# Altium project Camera Board.PrjPcb
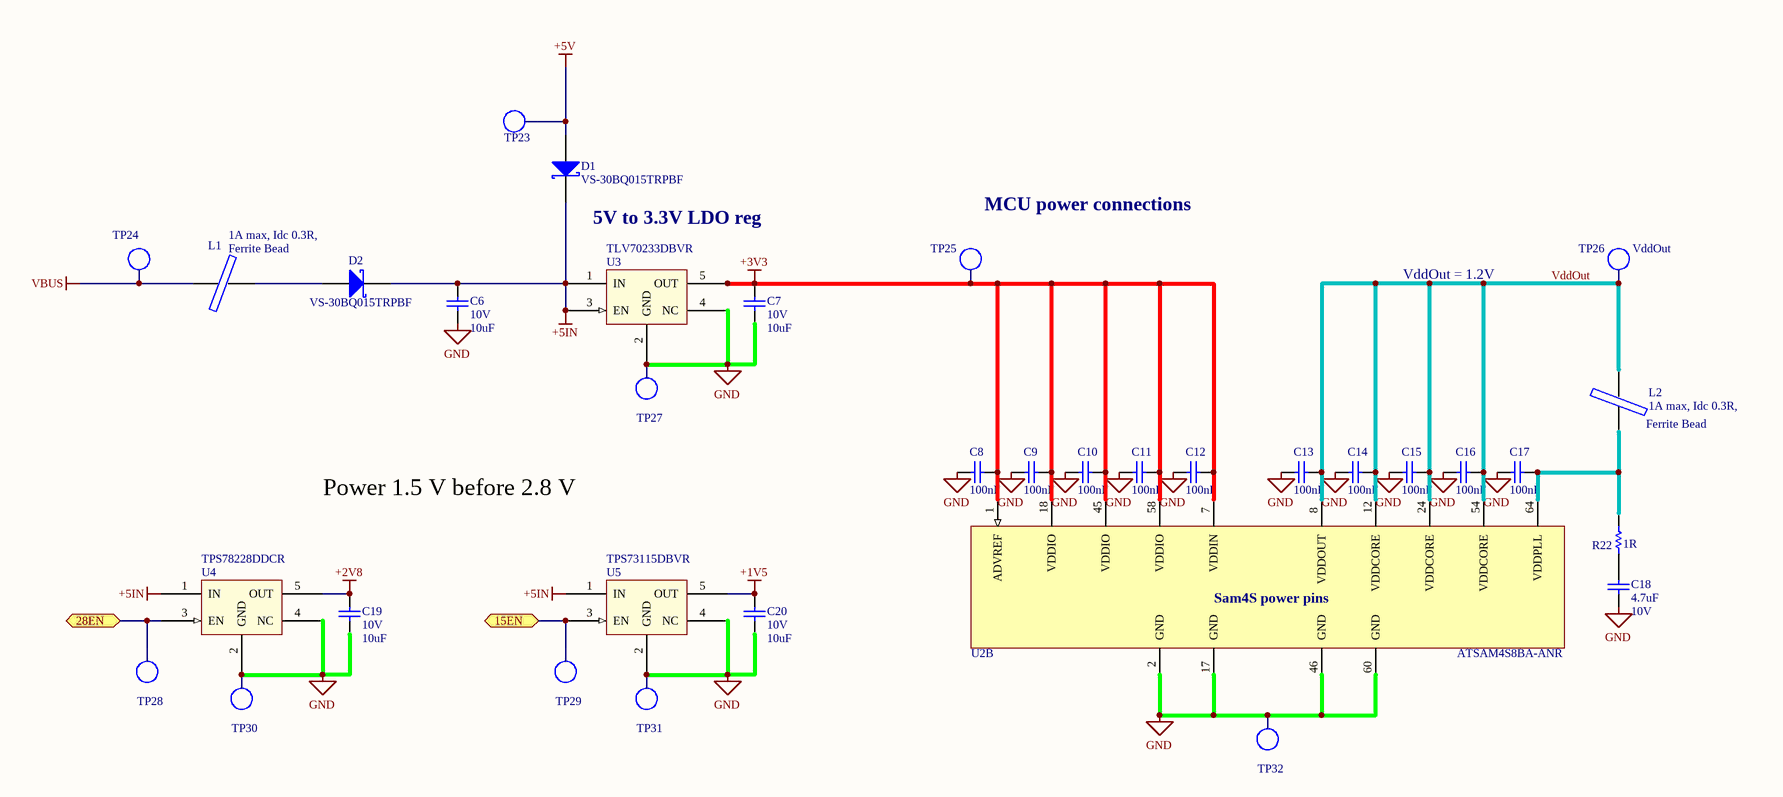
[diagram p0: Power_Distribution.SchDoc]
3 sheets, 98 parts. Net scope: flat (ports and power ports of the same name join across sheets).
Board file: Camera Board PCB.PcbDoc
Sheets:
  Power_Distribution.SchDoc
  Camera.SchDoc
  Camera_Board.SchDoc

## Sheet Power_Distribution.SchDoc: Sam4S Power Distribution - Group 7
size A3; DrawnBy: Lakshay Duggal, Thomas Hu; Address1: ECE Department; Address2: University of Canterbury; Address3: Christchurch 8041; Address4: New Zealand; Revision: 2; SheetNumber: 2; SheetTotal: 2; PageSetup: Record=PageOptions|CenterHorizontal=True|CenterVertical=True|PrintScale=1.04|XCorrection=1.00|YCorrection=1.00|PrintKind=0|BorderSize=5000000|LeftOffset=0|BottomOffset=0|Orientation=2|PaperLength=1000|PaperWidth=1000|Scale=100|PaperSource=7|PrintQuality=-3|MediaType=1|DitherType=10|PrintScaleMode=1|PaperKind=A3|PaperIndex=8

### Parts
C6  Voltage - Rated: 10V  [CAPC1608L]  (hidden comment: 10uF)
C7  Voltage - Rated: 10V  [CAPC1608L]  (hidden comment: 10uF)
C8  100nF  [CAPC1608L]
C9  100nF  [CAPC1608L]
C10  100nF  [CAPC1608L]
C11  100nF  [CAPC1608L]
C12  100nF  [CAPC1608L]
C13  100nF  [CAPC1608L]
C14  100nF  [CAPC1608L]
C15  100nF  [CAPC1608L]
C16  100nF  [CAPC1608L]
C17  100nF  [CAPC1608L]
C18  Max Voltage: 10V  [CAPC1608N]  (hidden comment: 4.7uF)
C19  Voltage - Rated: 10V  [CAPC1608L]  (hidden comment: 10uF)
C20  Voltage - Rated: 10V  [CAPC1608L]  (hidden comment: 10uF)
D1  VS-30BQ015TRPBF  [SMC]
D2  VS-30BQ015TRPBF  [SMC]
L1  Ferrite Bead  value 1A max, Idc 0.3R,  [INDC3216L]
L2  Ferrite Bead  value 1A max, Idc 0.3R,  [INDC3216L]
R22  1R  [RESC3216L]
TP23  V_Bus  [TP_0805]  (value not drawn)
TP24  V_Bus  [TP_0805]  (value not drawn)
TP25  3V3  [TP_0805]  (value not drawn)
TP26  VddOut  [TP_0805]
TP27  Gnd  [TP_0805]  (value not drawn)
TP28  Gnd  [TP_0805]  (value not drawn)
TP29  Gnd  [TP_0805]  (value not drawn)
TP30  Gnd  [TP_0805]  (value not drawn)
TP31  Gnd  [TP_0805]  (value not drawn)
TP32  Gnd  [TP_0805]  (value not drawn)
U2  ATSAM4S8BA-ANR  [LQFP64_L]  (part B of 2)
U3  TLV70233DBVR  [SOT95P280X145-5N]
U4  TPS78228DDCR  [SOT95P280X145-5N]
U5  TPS73115DBVR  [SOT95P280X145-5N]

### Ports
15EN, 28EN

### Nets
+1V5: C20.1 U5.5(OUT)
+2V8: C19.1 U4.5(OUT)
+3V3: C7.1 C8.2 C9.2 C10.2 C11.2 C12.2 TP25.1(TP) U2.1(ADVREF) U2.7(VDDIN) U2.18(VDDIO) U2.45(VDDIO) U2.58(VDDIO) U3.5(OUT)
+5IN: C6.1 D1.2(K) D2.2(K) U3.1(IN) U3.3(EN) U4.1(IN) U5.1(IN)
+5V: D1.1(A) TP23.1(TP)
GND: C6.2 C7.2 C8.1 C9.1 C10.1 C11.1 C12.1 C13.1 C14.1 C15.1 C16.1 C17.1 C18.1 C19.2 C20.2 TP27.1(TP) TP30.1(TP) TP31.1(TP) TP32.1(TP) U2.2(GND) U2.17(GND) U2.46(GND) U2.60(GND) U3.2(GND) U3.4(NC) U4.2(GND) U4.4(NC) U5.2(GND) U5.4(NC)
VBUS: L1.1 TP24.1(TP)
VddOut: C13.2 C14.2 C15.2 C16.2 L2.2 TP26.1(TP) U2.8(VDDOUT) U2.12(VDDCORE) U2.24(VDDCORE) U2.54(VDDCORE)
NetC17_2: C17.2 L2.1 R22.2 U2.64(VDDPLL)
NetC18_2: C18.2 R22.1
NetD2_1: D2.1(A) L1.2
NetTP28_1: TP28.1(TP) U4.3(EN) ; port 28EN
NetTP29_1: TP29.1(TP) U5.3(EN) ; port 15EN

### Notes on the sheet
- 5V to 3.3V LDO reg
- MCU power connections
- VddOut = 1.2V
- Power 1.5 V before 2.8 V
- (near U2) Sam4S power pins
- Title
- Drawn by:
- Date:
- Time:
- Revision:
- Sheet
- of
- File:

### Library data of the parts
C6 C7 C19 C20 = CC_10uF_0603: CAP CER 10UF X5R +-20% 10V 0603; Supplier: ECE Dept; Storage Location: PCB Assembly WS; Value: 10uF
C8-C17 = CC_100nF_0603: CAP CER 100nF X7R +-10% 50V 0603; PackageReference: 0603; Code_IPC: 1608 [0603]; Verify: *; Supplier: ECE Dept; Storage Location: PCB Assembly WS; Value: 100nF
C18 = CC_4.7uF_0603: CAP CER 4.7uF X5R +-20%  10V 0603; Note: Footprint corresponds to dimensions for bulk cassette packaging. This case size has tightened tolerances.; PackageReference: 0805; Code_IPC: 2012[0805]; Verify: *; Supplier: ECE Dept; Storage Location: PCB Assembly WS; Value: 4.7uF
D1 D2 = DS_VS-30BQD015TRPBF: DIODE SCHOTTKY 15V 3A SMC; Manufacturer: Vishay Semiconductor Diodes Division; Current - Reverse Leakage @ Vr: 4mA @ 15V; Voltage - Forward (Vf) (Max) @ If: 350mV @ 3A; Current - Average Rectified (Io): 3A; Package / Case: DO-214AB, SMC; Pricing: 1=1.59, 10=1.417, 25=1.2504, 100=1.1253, 250=0.97944, 500=0.87526, 1000=0.6877 (NZD); Supplier 1: Digi-Key; Supplier Part Number 1: 30BQ015PBFCT-ND; Supplier 2: Farnell; Supplier Part Number 2: 9101250; Supplier 3: Mouser; Supplier Part Number 3: N/A; Storage Location: PCB Assembly WS; Supplier: ECE Dept; Manufacturer Part Number: VS-30BQ015TRPBF
L1 L2 = IN_Ferrite-Bead: Ferrite Bead, Rdc 0.3R, Z100MHZ 600R, Imax 1A, SMD 1206; Manufacturer: FAIR-RITE; Manufacturer PN: 2512066017Y1; DC Current Rating: 1; DC Resistance Max: 0.08; Ferrite Case Style: 1206 ^3216 Metric]; Frequency Range: 50MHz to 1; Impedance: 600; Impedance Tolerance: ± 25%; Supplier: ECE Dept; Storage Location: PCB Assembly WS; Ferrite Mounting: SMD; Supplier 1: Farnell; Supplier Part Number 1: 1612060; Manufacturer Part Number: 2512066017Y1
R22 = RT_1R: RES 1R OHM 1/4W 5% 1206 SMD; Storage Location: PCB Assembly WS; Supplier: ECE Dept; Value: 1R
TP23-TP32 = TP_0805: Test Point 2.0X0.9X1.2mm SMD; Manufacturer: TE Connectivity AMP Connectors; Manufacturer Part Number: 1625854-2; Supplier 1: Digi-Key; Mounting Type: Surface Mount; Terminal: 0.079" x 0.049" x 0.057" (2.00mm x 1.25mm x 1.45mm); Type: PC Test Point; Supplier Part Number 1: A106144CT-ND
U2 = SE_ATSAM4S16BA-MU: IC MCU 32BIT 512KB FLASH 64LQFP; Manufacturer: Atmel; Connectivity: I²C, IrDA, Memory Card, SPI, SSC, UART/USART, USB; Core Processor: ARM® Cortex®-M4; Core Size: 32-Bit; Data Converters: A/D 11x12b, D/A 2x12b; Number of I/O: 47; Peripherals: Brown-out Detect/Reset, DMA, POR, PWM, WDT; Program Memory Size: 512KB (512K x 8); RAM Size: 128K x 8; Speed: 120MHz; Voltage - Supply (Vcc/Vdd): 1.62 V ~ 3.6 V; PackageVersion: revJ, Jul-2007; PackageReference: 64PS; PackageDescription: 64-Pin Quad Flat No-Lead (QFN) Sawn, 9 x 9 x 1.0 mm Body, 0.5 mm Pitch, Exposed Pad; Code_JEDEC: MO-220VMMD-3; ComponentLink1Description: Manufacturer URL; ComponentLink1URL: http://www.atmel.com/; ComponentLink2Description: SAM4S Series Datasheet; ComponentLink2URL: http://www.atmel.com/dyn/resources/prod_documents/11100.pdf; ComponentLink3Description: SAM4S Series Summary; ComponentLink3URL: http://www.atmel.com/dyn/resources/prod_documents/11100S.pdf; Supplier 1: Digi-Key; Package / Case: 64-LQFP; Packaging: Cut Tape (CT); Program Memory Type: FLASH; Supplier Part Number 1: ATSAM4S8BA-ANRCT-ND; Manufacturer Part Number: ATSAM4S8BA-ANR
U3 = SV_TLV70233DBVR: IC REG LDO 3.3V 0.3A SOT23-5; Manufacturer: Texas Instruments; Current - Output: 300mA; Supplier 1: Digi-Key; Operating Temperature: -40°C ~ 125°C; Package / Case: SC-74A, SOT-753; Pricing: 1=0.77, 10=0.647, 25=0.5672, 100=0.4853, 250=0.421, 500=0.35658, 750=0.30789, 1000=0.2749 (NZD); Supplier Part Number 1: 296-32415-1-ND; Manufacturer Part Number: TLV70233DBVR
U4 = SV_TLV70233DBVR: IC REG LDO 2.8V 0.3A SOT23-5; Manufacturer: Texas Instruments; Current - Output: 300mA; Supplier 1: Digi-Key; Operating Temperature: -40°C ~ 125°C; Package / Case: SC-74A, SOT-753; Pricing: 1=0.77, 10=0.647, 25=0.5672, 100=0.4853, 250=0.421, 500=0.35658, 750=0.30789, 1000=0.2749 (NZD); Supplier Part Number 1: 296-23826-2-ND; Manufacturer Part Number: TPS78228DDCR
U5 = SV_TLV70233DBVR: IC REG LDO 1.5V 0.3A SOT23-5; Manufacturer: Texas Instruments; Current - Output: 300mA; Supplier 1: Digi-Key; Operating Temperature: -40°C ~ 125°C; Package / Case: SC-74A, SOT-753; Pricing: 1=0.77, 10=0.647, 25=0.5672, 100=0.4853, 250=0.421, 500=0.35658, 750=0.30789, 1000=0.2749 (NZD); Supplier Part Number 1: 296-41769-2-ND; Manufacturer Part Number: TPS73115DBVR

## Sheet Camera.SchDoc: Camera Chip - Group 7
size A4; DrawnBy: Lakshay Duggal, Thomas Hu; Revision: 1.0; PageSetup: Record=PageOptions|CenterHorizontal=True|CenterVertical=True|PrintScale=1.42|XCorrection=1.00|YCorrection=1.00|PrintKind=1|BorderSize=5000000|LeftOffset=0|BottomOffset=0|Orientation=2|PaperLength=1000|PaperWidth=1000|Scale=100|PaperSource=7|PrintQuality=-3|MediaType=1|DitherType=10|PrintScaleMode=1|PaperKind=A3|PaperIndex=8
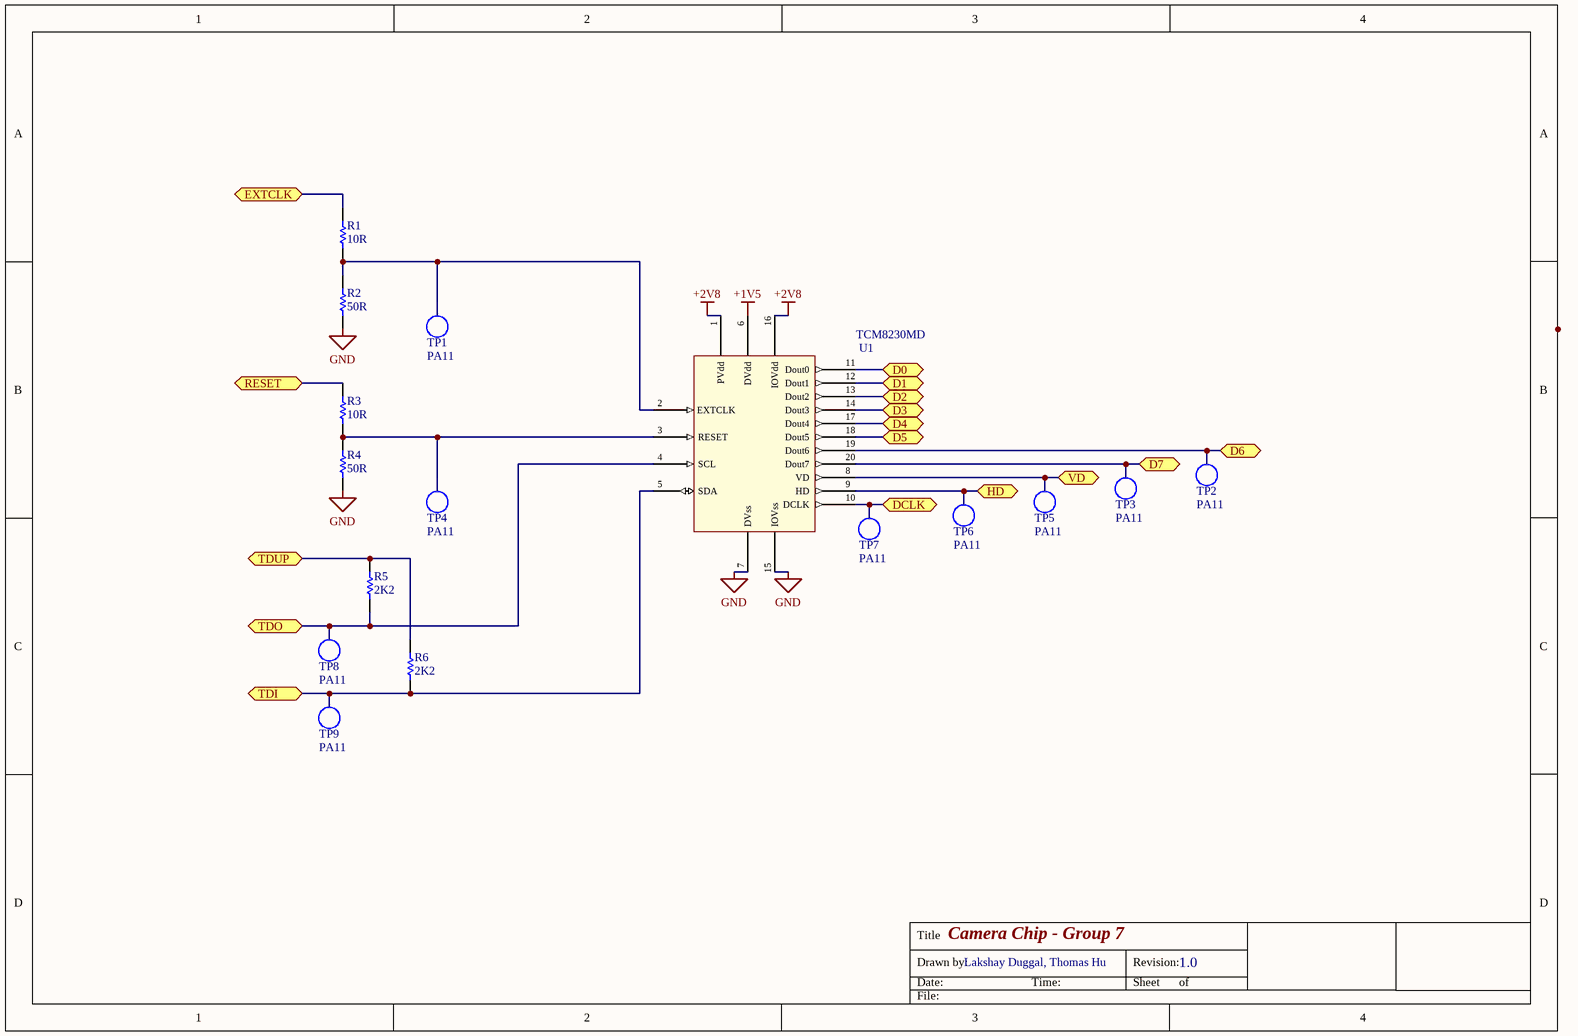
[diagram p1: Camera.SchDoc]

### Parts
R1  10R  [RESC1608L]
R2  50R  [RESC1608L]
R3  10R  [RESC1608L]
R4  50R  [RESC1608L]
R5  2K2  [RESC1608L]
R6  2K2  [RESC1608L]
TP1  PA11  [TP_0805]
TP2  PA11  [TP_0805]
TP3  PA11  [TP_0805]
TP4  PA11  [TP_0805]
TP5  PA11  [TP_0805]
TP6  PA11  [TP_0805]
TP7  PA11  [TP_0805]
TP8  PA11  [TP_0805]
TP9  PA11  [TP_0805]
U1  TCM8230MD  [TCM8230MD]

### Ports
D0, D1, D2, D3, D4, D5, D6, D7, DCLK, EXTCLK, HD, RESET, TDI, TDO, TDUP, VD

### Nets
+1V5: U1.6(DVdd)
+2V8: U1.1(PVdd) U1.16(IOVdd)
GND: R2.1 R4.1 U1.7(DVss) U1.15(IOVss)
NetR1_1: R1.1 R2.2 TP1.1(TP) U1.2(EXTCLK)
NetR1_2: R1.2 ; port EXTCLK
NetR3_1: R3.1 R4.2 TP4.1(TP) U1.3(RESET)
NetR3_2: R3.2 ; port RESET
NetR5_1: R5.1 TP8.1(TP) U1.4(SCL) ; port TDO
NetR5_2: R5.2 R6.2 ; port TDUP
NetR6_1: R6.1 TP9.1(TP) U1.5(SDA) ; port TDI
NetTP2_1: TP2.1(TP) U1.19(Dout6) ; port D6
NetTP3_1: TP3.1(TP) U1.20(Dout7) ; port D7
NetTP5_1: TP5.1(TP) U1.8(VD) ; port VD
NetTP6_1: TP6.1(TP) U1.9(HD) ; port HD
NetTP7_1: TP7.1(TP) U1.10(DCLK) ; port DCLK
NetU1_11: U1.11(Dout0) ; port D0
NetU1_12: U1.12(Dout1) ; port D1
NetU1_13: U1.13(Dout2) ; port D2
NetU1_14: U1.14(Dout3) ; port D3
NetU1_17: U1.17(Dout4) ; port D4
NetU1_18: U1.18(Dout5) ; port D5

### Notes on the sheet
- Title
- Drawn by:
- Date:
- Time:
- Revision:
- Sheet
- of
- File:

### Library data of the parts
R1-R6 = RS_2K2: RES 2.2K OHM 1/10W 5% 0603 SMD; Storage Location: PCB Assembly WS; Supplier: ECE Dept
  R1 R3: Value: 10R
  R2 R4: Value: 50R
  R5 R6: Value: 2K2
TP1-TP9 = TP_0805: as TP23 on sheet Power_Distribution; Supplier 1: Digi-Key; Mounting Type: Surface Mount; Terminal: 0.079" x 0.049" x 0.057" (2.00mm x 1.25mm x 1.45mm); Type: PC Test Point; Supplier Part Number 1: A106144CT-ND
U1 = TCM8230MD: Toshiba I2C Camera; Manufacturer: Toshiba; Manufacturers PN: TCM8230MD; Supplier 1: Spark Fun; Supplier 1 PN: 8667

## Sheet Camera_Board.SchDoc: Camera Board - Group 7
size A3; DrawnBy: Lakshay duggal, Thomas Hu; Address1: ECE Department; Address2: University of Canterbury; Address3: Christchurch 8041; Address4: New Zealand; Revision: 2; SheetNumber: 1; SheetTotal: 2; PageSetup: Record=PageOptions|CenterHorizontal=True|CenterVertical=True|PrintScale=1.04|XCorrection=1.00|YCorrection=1.00|PrintKind=0|BorderSize=5000000|LeftOffset=0|BottomOffset=0|Orientation=2|PaperLength=1000|PaperWidth=1000|Scale=100|PaperSource=7|PrintQuality=-3|MediaType=1|DitherType=10|PrintScaleMode=1|PaperKind=A3|PaperIndex=8
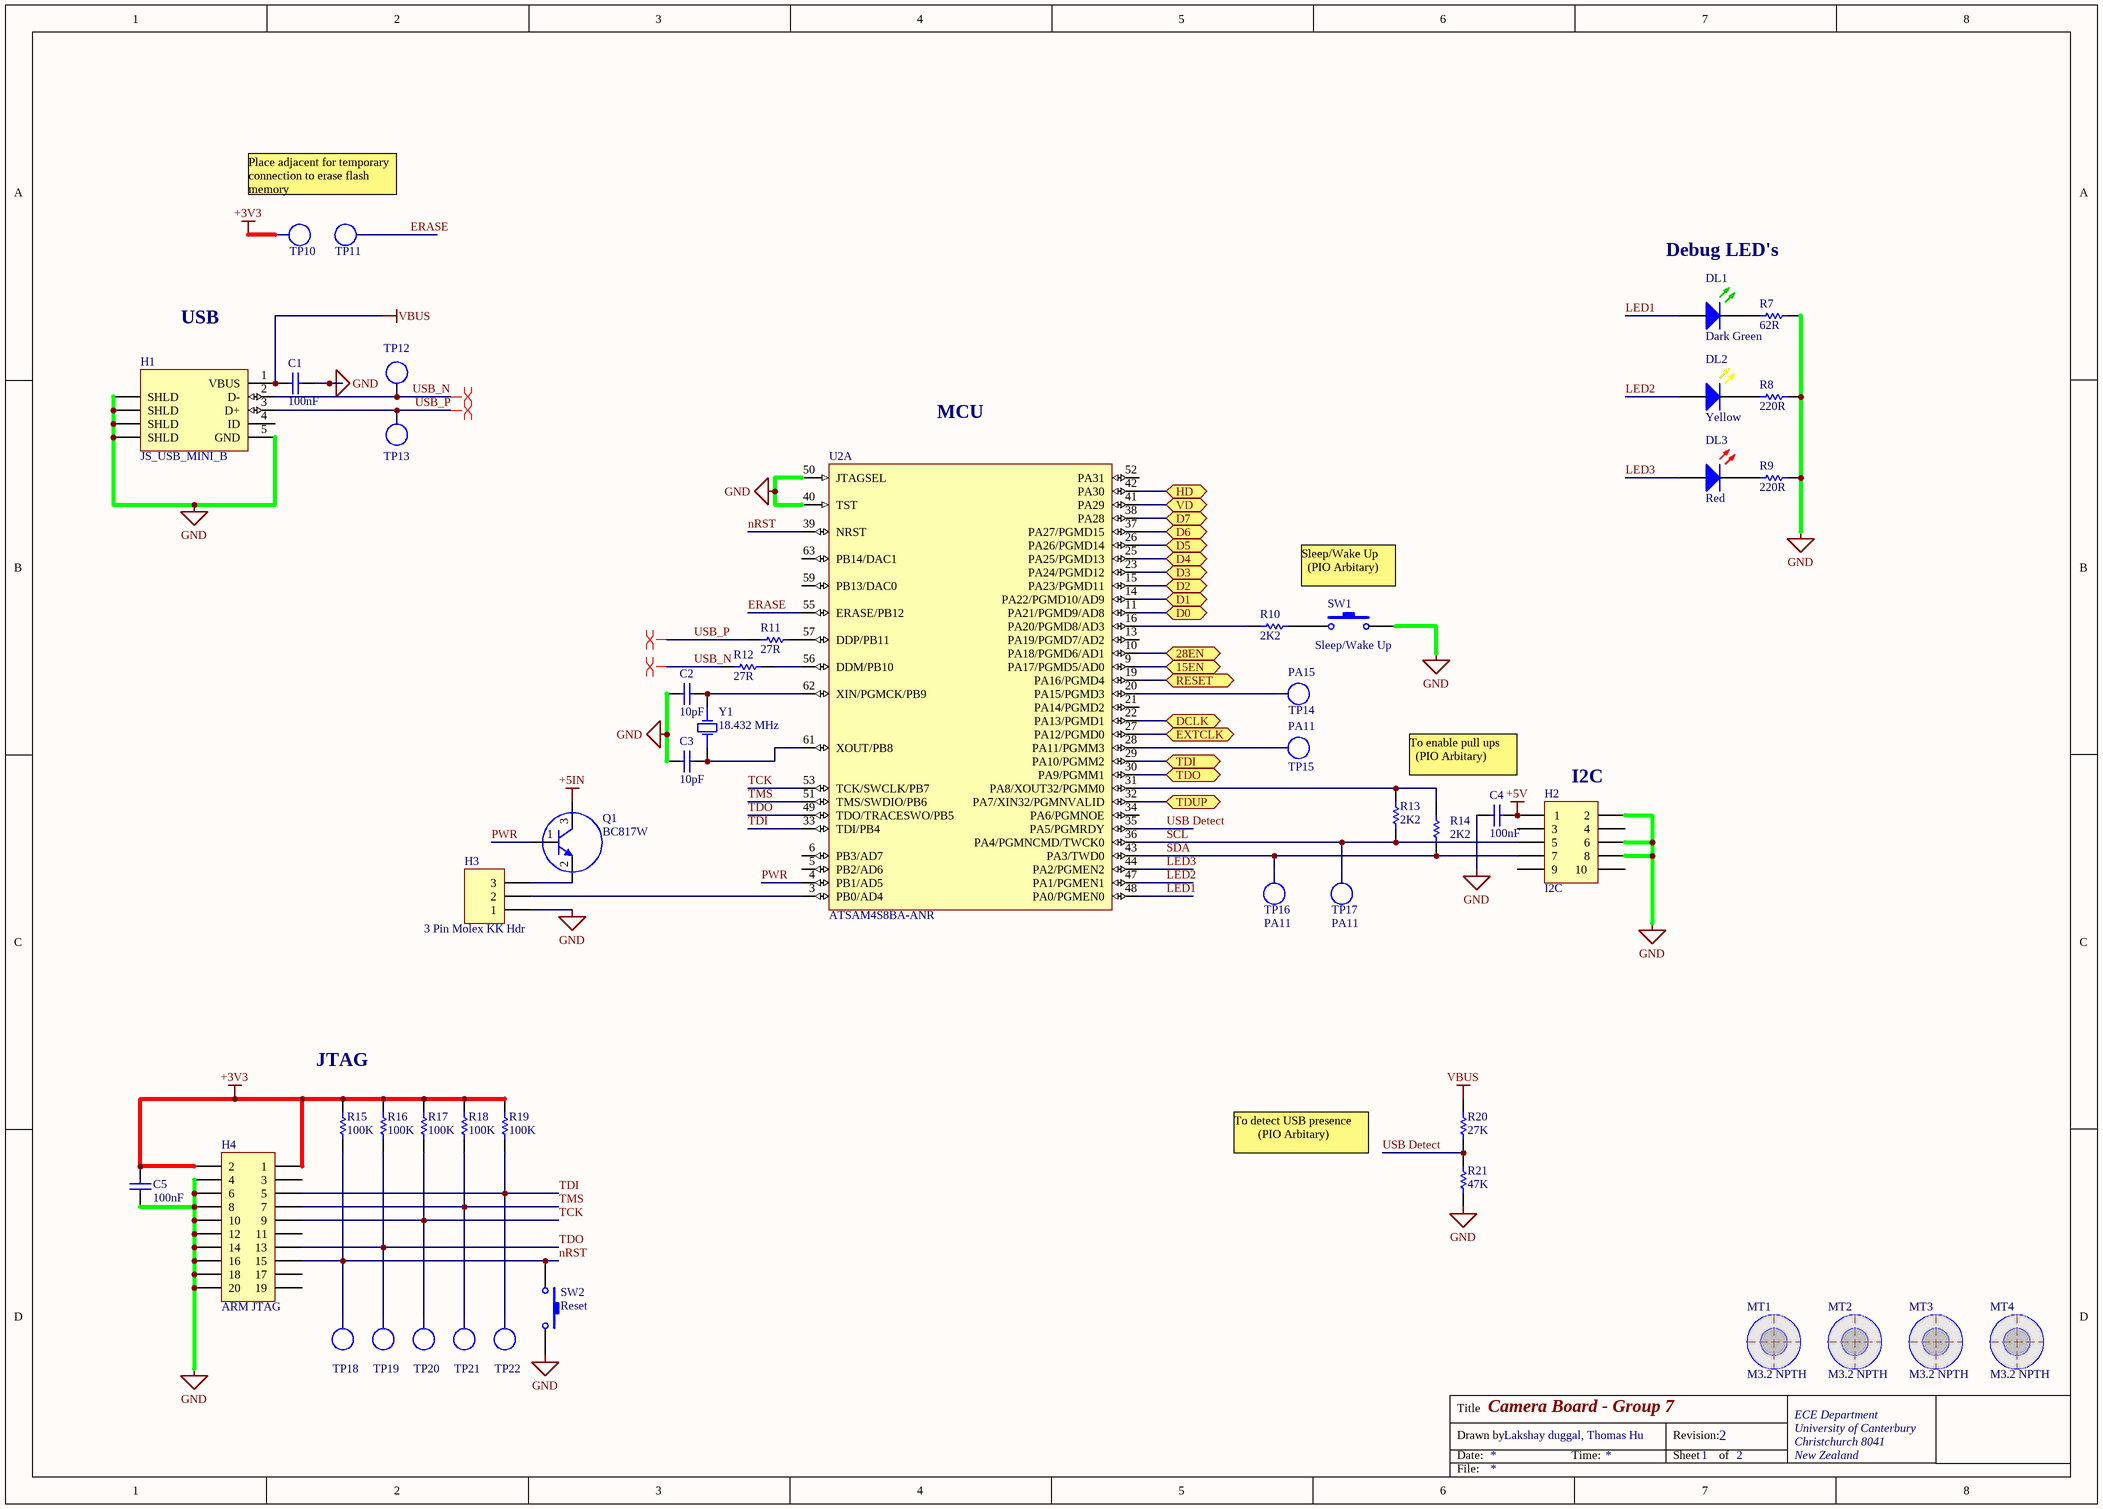
[diagram p2: Camera_Board.SchDoc]

### Parts
C1  100nF  [CAPC1608L]
C2  10pF  [CAPC1608L]
C3  10pF  [CAPC1608L]
C4  100nF  [CAPC1608L]
C5  100nF  [CAPC1608L]
DL1  Dark Green  [WL-SMCW0603]
DL2  Yellow  [WL-SMCW0603]
DL3  Red  [WL-SMCW0603]
H1  JS_USB_MINI_B  [USB/SM0.8-6H5]
H2  I2C  [188275-10]
H3  3 Pin Molex KK Hdr  [MOLEX_KK_3_HDR]
H4  ARM JTAG  [188275-20]
MT1  M3.2 NPTH  [MNT-HOLE_3.2mm_NPTH]  (no BOM)
MT2  M3.2 NPTH  [MNT-HOLE_3.2mm_NPTH]  (no BOM)
MT3  M3.2 NPTH  [MNT-HOLE_3.2mm_NPTH]  (no BOM)
MT4  M3.2 NPTH  [MNT-HOLE_3.2mm_NPTH]  (no BOM)
Q1  BC817W  [SOT323_M]
R7  62R  [RESC1608L]
R8  220R  [RESC1608L]
R9  220R  [RESC1608L]
R10  2K2  [RESC1608L]
R11  27R  [RESC1608L]
R12  27R  [RESC1608L]
R13  2K2  [RESC1608L]
R14  2K2  [RESC1608L]
R15  100K  [RESC1608L]
R16  100K  [RESC1608L]
R17  100K  [RESC1608L]
R18  100K  [RESC1608L]
R19  100K  [RESC1608L]
R20  27K  [RESC1608N]
R21  47K  [RESC1608N]
SW1  Sleep/Wake Up  [KSR211G]
SW2  Reset  [KSR211G]
TP10  3V3  [TP_0805]  (value not drawn)
TP11  Erase  [TP_0805]  (value not drawn)
TP12  USB_N  [TP_0805]  (value not drawn)
TP13  USB_P  [TP_0805]  (value not drawn)
TP14  PA15  [TP_0805]
TP15  PA11  [TP_0805]
TP16  PA11  [TP_0805]
TP17  PA11  [TP_0805]
TP18  nRST  [TP_0805]  (value not drawn)
TP19  TDO  [TP_0805]  (value not drawn)
TP20  TCK  [TP_0805]  (value not drawn)
TP21  TMS  [TP_0805]  (value not drawn)
TP22  TDI  [TP_0805]  (value not drawn)
U2  ATSAM4S8BA-ANR  [LQFP64_L]  (part A of 2)
Y1  18.432 MHz  [6.0X3.5-4]

### Ports
15EN, 28EN, D0, D1, D2, D3, D4, D5, D6, D7, DCLK, EXTCLK, HD, RESET, TDI, TDO, TDUP, VD

### Nets
+3V3: C5.2 H4.1 H4.2 R15.2 R16.2 R17.2 R18.2 R19.2 TP10.1(TP)
+5IN: Q1.3
+5V: C4.2 H2.1
GND: C1.2 C2.1 C3.1 C4.1 C5.1 H1.5(GND) H1.6(SHLD) H1.7(SHLD) H1.8(SHLD) H1.9(SHLD) H2.2 H2.6 H2.8 H3.1 H4.4 H4.6 H4.8 H4.10 H4.12 H4.14 H4.16 H4.18 H4.20 R7.2 R8.2 R9.2 R21.1 SW1.2 SW2.2 U2.40(TST) U2.50(JTAGSEL)
VBUS: C1.1 H1.1(VBUS) R20.2
ERASE: TP11.1(TP) U2.55(ERASE/PB12)
LED1: DL1.2(A) U2.48(PA0/PGMEN0)
LED2: DL2.2(A) U2.47(PA1/PGMEN1)
LED3: DL3.2(A) U2.44(PA2/PGMEN2)
nRST: H4.15 R15.1 SW2.1 TP18.1(TP) U2.39(NRST)
PWR: Q1.1 U2.4(PB1/AD5)
SCL: H2.5 R13.1 TP17.1(TP) U2.36(PA4/PGMNCMD/TWCK0)
SDA: H2.7 R14.1 TP16.1(TP) U2.43(PA3/TWD0)
TCK: H4.9 R17.1 TP20.1(TP) U2.53(TCK/SWCLK/PB7)
TDI: H4.5 R19.1 TP22.1(TP) U2.33(TDI/PB4)
TDO: H4.13 R16.1 TP19.1(TP) U2.49(TDO/TRACESWO/PB5)
TMS: H4.7 R18.1 TP21.1(TP) U2.51(TMS/SWDIO/PB6)
USB Detect: R20.1 R21.2 U2.35(PA5/PGMRDY)
USB_N: H1.2(D-) R12.1 TP12.1(TP)
USB_P: H1.3(D+) R11.1 TP13.1(TP)
NetC2_2: C2.2 U2.62(XIN/PGMCK/PB9) Y1.3(OSC2)
NetC3_2: C3.2 U2.61(XOUT/PB8) Y1.1(OSC1)
NetDL1_1: DL1.1(K) R7.1
NetDL2_1: DL2.1(K) R8.1
NetDL3_1: DL3.1(K) R9.1
NetH3_2: H3.2 U2.3(PB0/AD4)
NetH3_3: H3.3 Q1.2
NetR1_2: U2.27(PA12/PGMD0) ; port EXTCLK
NetR3_2: U2.19(PA16/PGMD4) ; port RESET
NetR5_1: U2.30(PA9/PGMM1) ; port TDO
NetR5_2: U2.32(PA7/XIN32/PGMNVALID) ; port TDUP
NetR6_1: U2.29(PA10/PGMM2) ; port TDI
NetR10_1: R10.1 U2.16(PA20/PGMD8/AD3)
NetR10_2: R10.2 SW1.1
NetR11_2: R11.2 U2.57(DDP/PB11)
NetR12_2: R12.2 U2.56(DDM/PB10)
NetR13_2: R13.2 R14.2 U2.31(PA8/XOUT32/PGMM0)
NetTP2_1: U2.37(PA27/PGMD15) ; port D6
NetTP3_1: U2.38(PA28) ; port D7
NetTP5_1: U2.41(PA29) ; port VD
NetTP6_1: U2.42(PA30) ; port HD
NetTP7_1: U2.22(PA13/PGMD1) ; port DCLK
NetTP14_1: TP14.1(TP) U2.20(PA15/PGMD3)
NetTP15_1: TP15.1(TP) U2.28(PA11/PGMM3)
NetTP28_1: U2.10(PA18/PGMD6/AD1) ; port 28EN
NetTP29_1: U2.9(PA17/PGMD5/AD0) ; port 15EN
NetU1_11: U2.11(PA21/PGMD9/AD8) ; port D0
NetU1_12: U2.14(PA22/PGMD10/AD9) ; port D1
NetU1_13: U2.15(PA23/PGMD11) ; port D2
NetU1_14: U2.23(PA24/PGMD12) ; port D3
NetU1_17: U2.25(PA25/PGMD13) ; port D4
NetU1_18: U2.26(PA26/PGMD14) ; port D5

Not connected (* = marked no-connect by the designer): H1 4(ID); H2 3 4 9 10; H4 3 11 17 19; U2 5(PB2/AD6) 6(PB3/AD7) 13(PA19/PGMD7/AD2) 21(PA14/PGMD2) 34(PA6/PGMNOE) 52(PA31) 59(PB13/DAC0) 63(PB14/DAC1)

### Layout directives
differential pair: USB_N, USB_P

### Notes on the sheet
- Place adjacent for temporary
  connection to erase flash
  memory
- Debug LED's
- USB
- MCU
- Sleep/Wake Up
  (PIO Arbitary)
- To enable pull ups
  (PIO Arbitary)
- (near H2) I2C
- JTAG
- To detect USB presence
  (PIO Arbitary)
- Title
- Drawn by:
- Date:
- Time:
- Revision:
- Sheet
- of
- File:

### Library data of the parts
C1 C4 C5 = CC_100nF_0603: CAP CER 100nF X7R +-10% 50V 0603; PackageReference: 0603; Code_IPC: 1608 [0603]; Verify: *; Supplier: ECE Dept; Storage Location: PCB Assembly WS; Value: 100nF
C2 C3 = CC_10pF_0603: CAP CER 10pF COG/NPO 50V 0603; PackageReference: 0603; Code_IPC: 1005 [0402]; Verify: *; Supplier: ECE Dept; Storage Location: PCB Assembly WS; Value: 10pF
DL1 = DL_150060GS75000: LED Dk Green 430mcd 0603 SMD; Manufacturer: WURTH ELEKTRONIK; Forward Current If: 30; Wavelength Typ: 520; Forward Voltage: 3.2; Lens Shape: Rectangular; Luminous Intensity: 430; Viewing Angle: 140°; LED Mounting: SMD; Supplier 1: Farnell; Supplier Part Number 1: 2322070; Manufacturer Part Number: 150060GS75000; Storage Location: PCB Assembly WS; Supplier: ECE Dept; LED Colour: Dark Green
DL2 = DL_150060YS75000: LED Yellow 120mcd 0603 SMD; Manufacturer: WURTH ELEKTRONIK; Forward Current If: 30; Forward Voltage: 2; Wavelength Typ: 590; Lens Shape: Rectangular; Viewing Angle: 140°; Luminous Intensity: 120; LED Mounting: SMD; Supplier 1: Farnell; Supplier Part Number 1: 2322074; Manufacturer Part Number: 150060YS75000; Storage Location: PCB Assembly WS; Supplier: ECE Dept; LED Colour: Yellow
DL3 = DL_150060RS75000: LED Red 250mcd 0603 SMD; Manufacturer: WURTH ELEKTRONIK; Forward Current If: 30; Forward Voltage: 2; Lens Shape: Rectangular; Luminous Intensity: 250; Wavelength Typ: 625; Viewing Angle: 140°; LED Mounting: SMD; Supplier 1: Farnell; Supplier Part Number 1: 2322071; Manufacturer Part Number: 150060RS75000; Storage Location: PCB Assembly WS; Supplier: ECE Dept; LED Colour: Red
H1 = JS_USB_MINI_B_SMT: USB 2.0, Right Angle, SMT, B Type, Receptacle, 5 Position,; Manufacturer: FCI; Manufacturer PN: 10033526-N3212MLF; Supplier 1: Farnell; Supplier Part Number 1: 1824416; Storage Location: PCB Assembly WS; Supplier: ECE Dept
H2 = JB_HDR_IDC_5X2_VERT: IDC Header, 1,27mm, 10-Pin, Vert, SMT; Manufacturer: TE Connectivity; Manufacturer Part Number: 1-188275-0; Current Rating: 1.5 A; Mounting Angle: Vertical; Number of Positions / Contacts: 10; Pitch: 1.27 mm; Supplier: ECE Dept; Mounting Style: SMD/SMT; Storage Location: PCB Assembly WS; Supplier 1: Digi-Key; Supplier Part Number 1: A99476TR-ND
H3 = JA_MOLEX_KK_3POS: CONN HEADER 3POS 2.54mm VERT_Thru Hole; Manufacturer: Molex; Manufacturer PN: 22-23-2031; Supplier Part Number 1: 9731156; Supplier: ECE Dept; Supplier 1: Farnell; Storage Location: ECE Dept Store; Value: 3 Pin Molex KK Hdr
H4 = JB_HDR_IDC_10X2_VERT: IDC Header, 1,27mm, 20-Pin, Vert, SMT; Manufacturer: TE Connectivity; Manufacturer Part Number: 2-188275-0; Mounting Angle: Vertical; Number of Positions / Contacts: 20; Pitch: 1.27 mm; Mounting Style: SMD/SMT; Supplier: ECE Dept; Storage Location: PCB Assembly WS; Supplier 1: Digi-Key; Supplier Part Number 1: A99481CT-ND
MT1-MT4 = MC_M3.2_HOLE: Fixing M3.2 Mount Hole NPTH; Manufacturer: Hi-Q; Manufacturer PN: 3BV series M3 Clearance; price: 0; Supplier: ECE Dept; value: M3.2 NPTH
Q1 = TB_BC817W: NPN GP Bipolar Transistor 45V 500mA SOT323; Manufacturer: NXP; Supplier 1: Farnell; Supplier Part Number 1: 2114873; Manufacturer PN: BC817W; Storage Location: PCB Assembly WS; Supplier: ECE Dept; Value: BC817W
R7 = RS_62R: RES 62 OHM 1/10W 5% 0603 SMD; Storage Location: PCB Assembly WS; Supplier: ECE Dept; Value: 62R
R8 R9 = RS_220R: RES 220 OHM 1/10W 5% 0603 SMD; Storage Location: PCB Assembly WS; Supplier: ECE Dept; Value: 220R
R10 R13 R14 = RS_2K2: RES 2.2K OHM 1/10W 5% 0603 SMD; Storage Location: PCB Assembly WS; Supplier: ECE Dept; Value: 2K2
R11 R12 = RS_27R: RES 27 OHM 1/10W 5% 0603 SMD; Storage Location: PCB Assembly WS; Supplier: ECE Dept; Value: 27R
R15-R19 = RS_100K: RES 100K OHM 1/10W 5% 0603 SMD; Storage Location: PCB Assembly WS; Supplier: ECE Dept; Value: 100K
R20 = RS_27K: RES 27K OHM 1/10W 5% 0603 SMD; Storage Location: PCB Assembly WS; Supplier: ECE Dept; Value: 27K
R21 = RS_47K: RES 47.0K OHM 1/10W 5% 0603 SMD; Storage Location: PCB Assembly WS; Supplier: ECE Dept; Value: 47K
SW1 SW2 = WS_KSR211G LFS: SWITCH TACTILE SPST-NO SMD; Manufacturer: C & K COMPONENTS; Contact Current Max: 50; Contact Resistance: 100; Contact Voltage DC Nom: 32; Operating Force: 1.8; Contact Configuration: SPST-NO; Pricing: 1=0.538, 50=0.477, 100=0.416, 2500=0.219 (NZD); Supplier 1: Farnell; Supplier Part Number 1: 1437634; Storage Location: PCB Assembly WS; Supplier: ECE Dept; Manufacturer Part Number: KSR211G LFS
TP10-TP22 = TP_0805: as TP23 on sheet Power_Distribution; Supplier 1: Digi-Key; Mounting Type: Surface Mount; Terminal: 0.079" x 0.049" x 0.057" (2.00mm x 1.25mm x 1.45mm); Type: PC Test Point; Supplier Part Number 1: A106144CT-ND
U2 = SE_ATSAM4S16BA-MU: as U2 on sheet Power_Distribution; PackageVersion: revJ, Jul-2007; PackageReference: 64PS; PackageDescription: 64-Pin Quad Flat No-Lead (QFN) Sawn, 9 x 9 x 1.0 mm Body, 0.5 mm Pitch, Exposed Pad; Code_JEDEC: MO-220VMMD-3; ComponentLink1Description: Manufacturer URL; ComponentLink1URL: http://www.atmel.com/; ComponentLink2Description: SAM4S Series Datasheet; ComponentLink2URL: http://www.atmel.com/dyn/resources/prod_documents/11100.pdf; ComponentLink3Description: SAM4S Series Summary; ComponentLink3URL: http://www.atmel.com/dyn/resources/prod_documents/11100S.pdf; Supplier 1: Digi-Key; Package / Case: 64-LQFP; Packaging: Cut Tape (CT); Program Memory Type: FLASH; Supplier Part Number 1: ATSAM4S8BA-ANRCT-ND; Manufacturer Part Number: ATSAM4S8BA-ANR
Y1 = XT_CRYSTAL_18.432MHz_13pF: 18.432 MHZ 4PF  6.0X3.5mm SMD; Manufacturer: CTS-Frequency Controls; Manufacturer Part Number: 406C35B18M43200; ESR (Equivalent Series Resistance): 40 Ohm; Frequency Stability: ±50ppm; Frequency Tolerance: ±30ppm; Load Capacitance: 13pF; Supplier 1: Digi-Key; Height: 0.047" (1.20mm); Mounting Type: Surface Mount; Package / Case: 4-SMD, No Lead (DFN, LCC); Size / Dimension: 0.236" L x 0.138" W (6.00mm x 3.50mm); Supplier Part Number 1: CTX668CT-ND; Frequency: 18.432 MHz

## Nets that join several sheets
+1V5: Power_Distribution (C20.1 U5.5), Camera (U1.6)
+2V8: Power_Distribution (C19.1 U4.5), Camera (U1.1 U1.16)
+3V3: Power_Distribution (13 pins), Camera_Board (9 pins)
+5IN: Power_Distribution (7 pins), Camera_Board (Q1.3)
+5V: Power_Distribution (D1.1 TP23.1), Camera_Board (C4.2 H2.1)
GND: Power_Distribution (29 pins), Camera (R2.1 R4.1 U1.7 U1.15), Camera_Board (31 pins)
VBUS: Power_Distribution (L1.1 TP24.1), Camera_Board (C1.1 H1.1 R20.2)
NetR1_2: Camera (R1.2), Camera_Board (U2.27)
NetR3_2: Camera (R3.2), Camera_Board (U2.19)
NetR5_1: Camera (R5.1 TP8.1 U1.4), Camera_Board (U2.30)
NetR5_2: Camera (R5.2 R6.2), Camera_Board (U2.32)
NetR6_1: Camera (R6.1 TP9.1 U1.5), Camera_Board (U2.29)
NetTP2_1: Camera (TP2.1 U1.19), Camera_Board (U2.37)
NetTP3_1: Camera (TP3.1 U1.20), Camera_Board (U2.38)
NetTP5_1: Camera (TP5.1 U1.8), Camera_Board (U2.41)
NetTP6_1: Camera (TP6.1 U1.9), Camera_Board (U2.42)
NetTP7_1: Camera (TP7.1 U1.10), Camera_Board (U2.22)
NetTP28_1: Power_Distribution (TP28.1 U4.3), Camera_Board (U2.10)
NetTP29_1: Power_Distribution (TP29.1 U5.3), Camera_Board (U2.9)
NetU1_11: Camera (U1.11), Camera_Board (U2.11)
NetU1_12: Camera (U1.12), Camera_Board (U2.14)
NetU1_13: Camera (U1.13), Camera_Board (U2.15)
NetU1_14: Camera (U1.14), Camera_Board (U2.23)
NetU1_17: Camera (U1.17), Camera_Board (U2.25)
NetU1_18: Camera (U1.18), Camera_Board (U2.26)